# Altium schematic sheet Tele.SchDoc
size A4
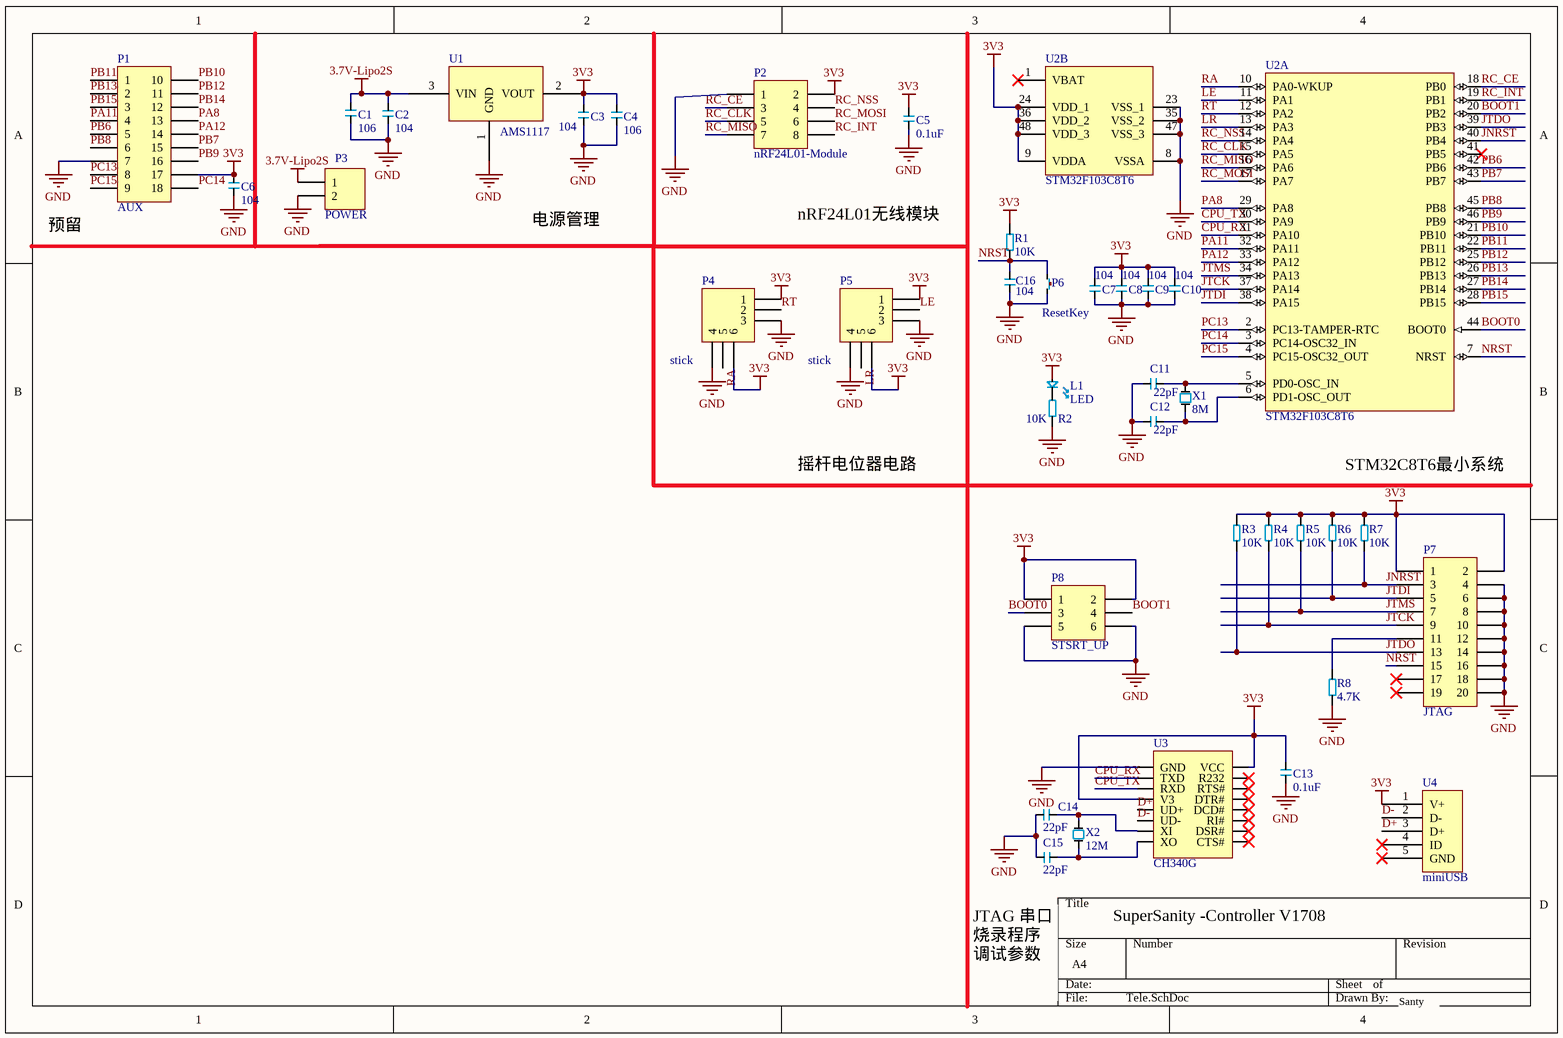
[diagram p0: Tele.SchDoc]

## Parts
C1  106  [LC-0402]
C2  104  [LC-0402]
C3  104  [LC-0402]
C4  106  [LC-0402]
C5  0.1uF  [LC-0402]
C6  104  [LC-0402]
C7  104  [LC-0402]
C8  104  [LC-0402]
C9  104  [LC-0402]
C10  104  [LC-0402]
C11  22pF  [LC-0402]
C12  22pF  [LC-0402]
C13  0.1uF  [LC-0402]
C14  22pF  [LC-0402]
C15  22pF  [LC-0402]
C16  104  [LC-0402]
L1  LED  [0603_LED_S1]
P1  AUX  [HDR2X9_CEN]
P2  nRF24L01-Module  [HDR2X4]
P3  POWER  [HDR1X2]
P4  stick  [Stick]
P5  stick  [Stick]
P6  ResetKey  [ResetKeyC5382]
P7  JTAG  [HDR2X10]
P8  STSRT_UP  [HDR2X3]
R1  10K  [Res-0402]
R2  10K  [Res-0402]
R3  10K  [Res-0402]
R4  10K  [Res-0402]
R5  10K  [Res-0402]
R6  10K  [Res-0402]
R7  10K  [Res-0402]
R8  4.7K  [Res-0402]
U1  AMS1117  [AMS1117]
U2  STM32F103C8T6  [STM-LQFP48_L]  (parts A,B of 2)
U3  CH340G  [LC-SOP-16_150mil]
U4  miniUSB  [miniUSB]
X1  8M  [LC-HC-49SMD]
X2  12M  [LC-HC-49SMD]

## Nets
3.7V-Lipo2S: C1.1 C2.1 P3.1 U1.3(VIN)
3V3: C3.1 C4.1 C5.1 C6.1 C7.1 C8.1 C9.1 C10.1 C13.1 L1.P P1.17 P2.2 P4.1 P4.6 P5.1 P5.6 P7.1 P7.2 P8.1 P8.2 R1.0 R3.0 R4.0 R5.0 R6.0 R7.0 U1.2(VOUT) U2.9(VDDA) U2.24(VDD_1) U2.36(VDD_2) U2.48(VDD_3) U3.4(V3) U3.16(VCC) U4.1(V+)
GND: C1.0 C2.0 C3.0 C4.0 C5.0 C6.0 C7.0 C8.0 C9.0 C10.0 C11.0 C12.0 C13.0 C14.0 C15.0 C16.0 P1.7 P2.1 P3.2 P4.3 P4.4 P5.3 P5.4 P6.0 P7.4 P7.6 P7.8 P7.10 P7.12 P7.14 P7.16 P7.18 P7.20 P8.5 P8.6 R2.1 R8.1 U1.1(GND) U2.8(VSSA) U2.23(VSS_1) U2.35(VSS_2) U2.47(VSS_3) U3.1(GND)
BOOT0: P8.3 U2.44(BOOT0)
BOOT1: P8.4 U2.20(PB2)
CPU_RX: U2.31(PA10) U3.2(TXD)
CPU_TX: U2.30(PA9) U3.3(RXD)
D+: U3.5(UD+) U4.3(D+)
D-: U3.6(UD-) U4.2(D-)
JNRST: P7.3 R7.1 U2.40(PB4)
JTCK: P7.9 R4.1 U2.37(PA14)
JTDI: P7.5 R6.1 U2.38(PA15)
JTDO: P7.13 R3.1 U2.39(PB3)
JTMS: P7.7 R5.1 U2.34(PA13)
LE: P5.2 U2.11(PA1)
LR: P5.5 U2.13(PA3)
NRST: C16.1 P6.1 P7.15 R1.1 U2.7(NRST)
PA8: P1.13 U2.29(PA8)
PA11: P1.4 U2.32(PA11)
PA12: P1.14 U2.33(PA12)
PB6: P1.5 U2.42(PB6)
PB7: P1.15 U2.43(PB7)
PB8: P1.6 U2.45(PB8)
PB9: P1.16 U2.46(PB9)
PB10: P1.10 U2.21(PB10)
PB11: P1.1 U2.22(PB11)
PB12: P1.11 U2.25(PB12)
PB13: P1.2 U2.26(PB13)
PB14: P1.12 U2.27(PB14)
PB15: P1.3 U2.28(PB15)
PC13: P1.8 U2.2(PC13-TAMPER-RTC)
PC14: P1.18 U2.3(PC14-OSC32_IN)
PC15: P1.9 U2.4(PC15-OSC32_OUT)
RA: P4.5 U2.10(PA0-WKUP)
RC_CE: P2.3 U2.18(PB0)
RC_CLK: P2.5 U2.15(PA5)
RC_INT: P2.8 U2.19(PB1)
RC_MISO: P2.7 U2.16(PA6)
RC_MOSI: P2.6 U2.17(PA7)
RC_NSS: P2.4 U2.14(PA4)
RT: P4.2 U2.12(PA2)
NetC11_1: C11.1 U2.5(PD0-OSC_IN) X1.0
NetC12_1: C12.1 U2.6(PD1-OSC_OUT) X1.1
NetC14_1: C14.1 U3.7(XI) X2.0
NetC15_1: C15.1 U3.8(XO) X2.1
NetL1_N: L1.N R2.0
NetP7_11: P7.11 R8.0

Not connected (* = marked no-connect by the designer): P7 17* 19*; U2 1(VBAT)* 41(PB5)*; U3 9(CTS#)* 10(DSR#)* 11(RI#)* 12(DCD#)* 13(DTR#)* 14(RTS#)* 15(R232)*; U4 4(ID)* 5(GND)*

## Notes on the sheet
- 预留
- 电源管理
- nRF24L01无线模块
- 摇杆电位器电路
- STM32C8T6最小系统
- SuperSanity -Controller V1708
- JTAG 串口烧录程序 调试参数
- Santy

## Library data of the parts
C1-C16 = Cap-0402
P1 = Header 9X2A: Header, 9-Pin, Dual row; LatestRevisionDate: 17-Jul-2002; LatestRevisionNote: Re-released for DXP Platform.; Publisher: Altium Limited
P2 = Header 4X2: Header, 4-Pin, Dual row; LatestRevisionDate: 17-Jul-2002; LatestRevisionNote: Re-released for DXP Platform.; Publisher: Altium Limited
P3 = Header 2: Header, 2-Pin; LatestRevisionDate: 17-Jul-2002; LatestRevisionNote: Re-released for DXP Platform.; Publisher: Altium Limited
P6 = ResetKey_C5382
P7 = Header 10X2: Header, 10-Pin, Dual row; LatestRevisionDate: 17-Jul-2002; LatestRevisionNote: Re-released for DXP Platform.; Publisher: Altium Limited
P8 = Header 3X2: Header, 3-Pin, Dual row; LatestRevisionDate: 17-Jul-2002; LatestRevisionNote: Re-released for DXP Platform.; Publisher: Altium Limited
R1-R8 = Res-0402
U2 = STM32F103C8T6: ARM Cortex-M3 32-bit MCU, 64 KB Flash, 20 KB Internal RAM, 37 I/Os, 48-pin LQFP, -40 to 85 degC, Tray; A/D Converter: 2x12-bit (10 Channel); FLASH Size (Prog) (kB): 64; I/Os (High Current): 37; Internal RAM Size (kB): 20; Operating Frequency(F) (Processor speed) (MHz): 72; Supply Voltage(Vcc) min (V): 2; DatasheetVersion: Rev. 16; PackageVersion: Rev. 6, 06/2013; PackageReference: LQFP48; PackageDescription: 48-Pin Low Profile Quad Flat Package, 7 x 7 mm Body, 0.5 mm Pitch; Supplier 1: Digi-Key; Supplier Part Number 1: 497-6063-ND; Supplier 2: Farnell; Supplier Part Number 2: 1447637; Supplier 3: Newark; Supplier Part Number 3: 59M2182; Supplier 4: Newark; Supplier Part Number 4: 57P1222; Supplier 5: Mouser; Supplier Part Number 5: 511-STM32F103C8T6; Core: ARM Cortex-M3; Packing: Tray; Mounting Technology: Surface Mount; PartNumber: STM32F103C8T6; ComponentLink1Description: Manufacturer URL; ComponentLink1URL: http://www.st.com/web/en/home.html; ComponentLink2Description: Datasheet; ComponentLink2URL: http://www.st.com/st-web-ui/static/active/en/resource/technical/document/datasheet/CD00161566.pdf; ComponentLink3Description: Package Specification; ComponentLink3URL: http://www.st.com/st-web-ui/static/active/en/resource/technical/document/datasheet/DM00058181.pdf
X1 X2 = 49SMD